# EAGLE schematic Interconnect_board_v1p12 (EAGLE 9.4.2)
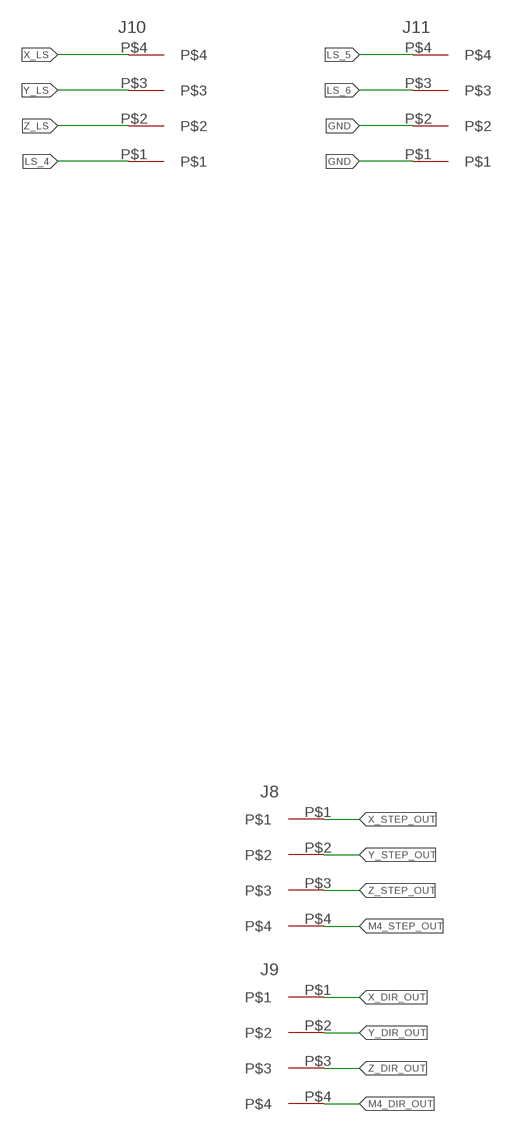
[diagram p0: schematic, sheet 1, part 1 of 2]
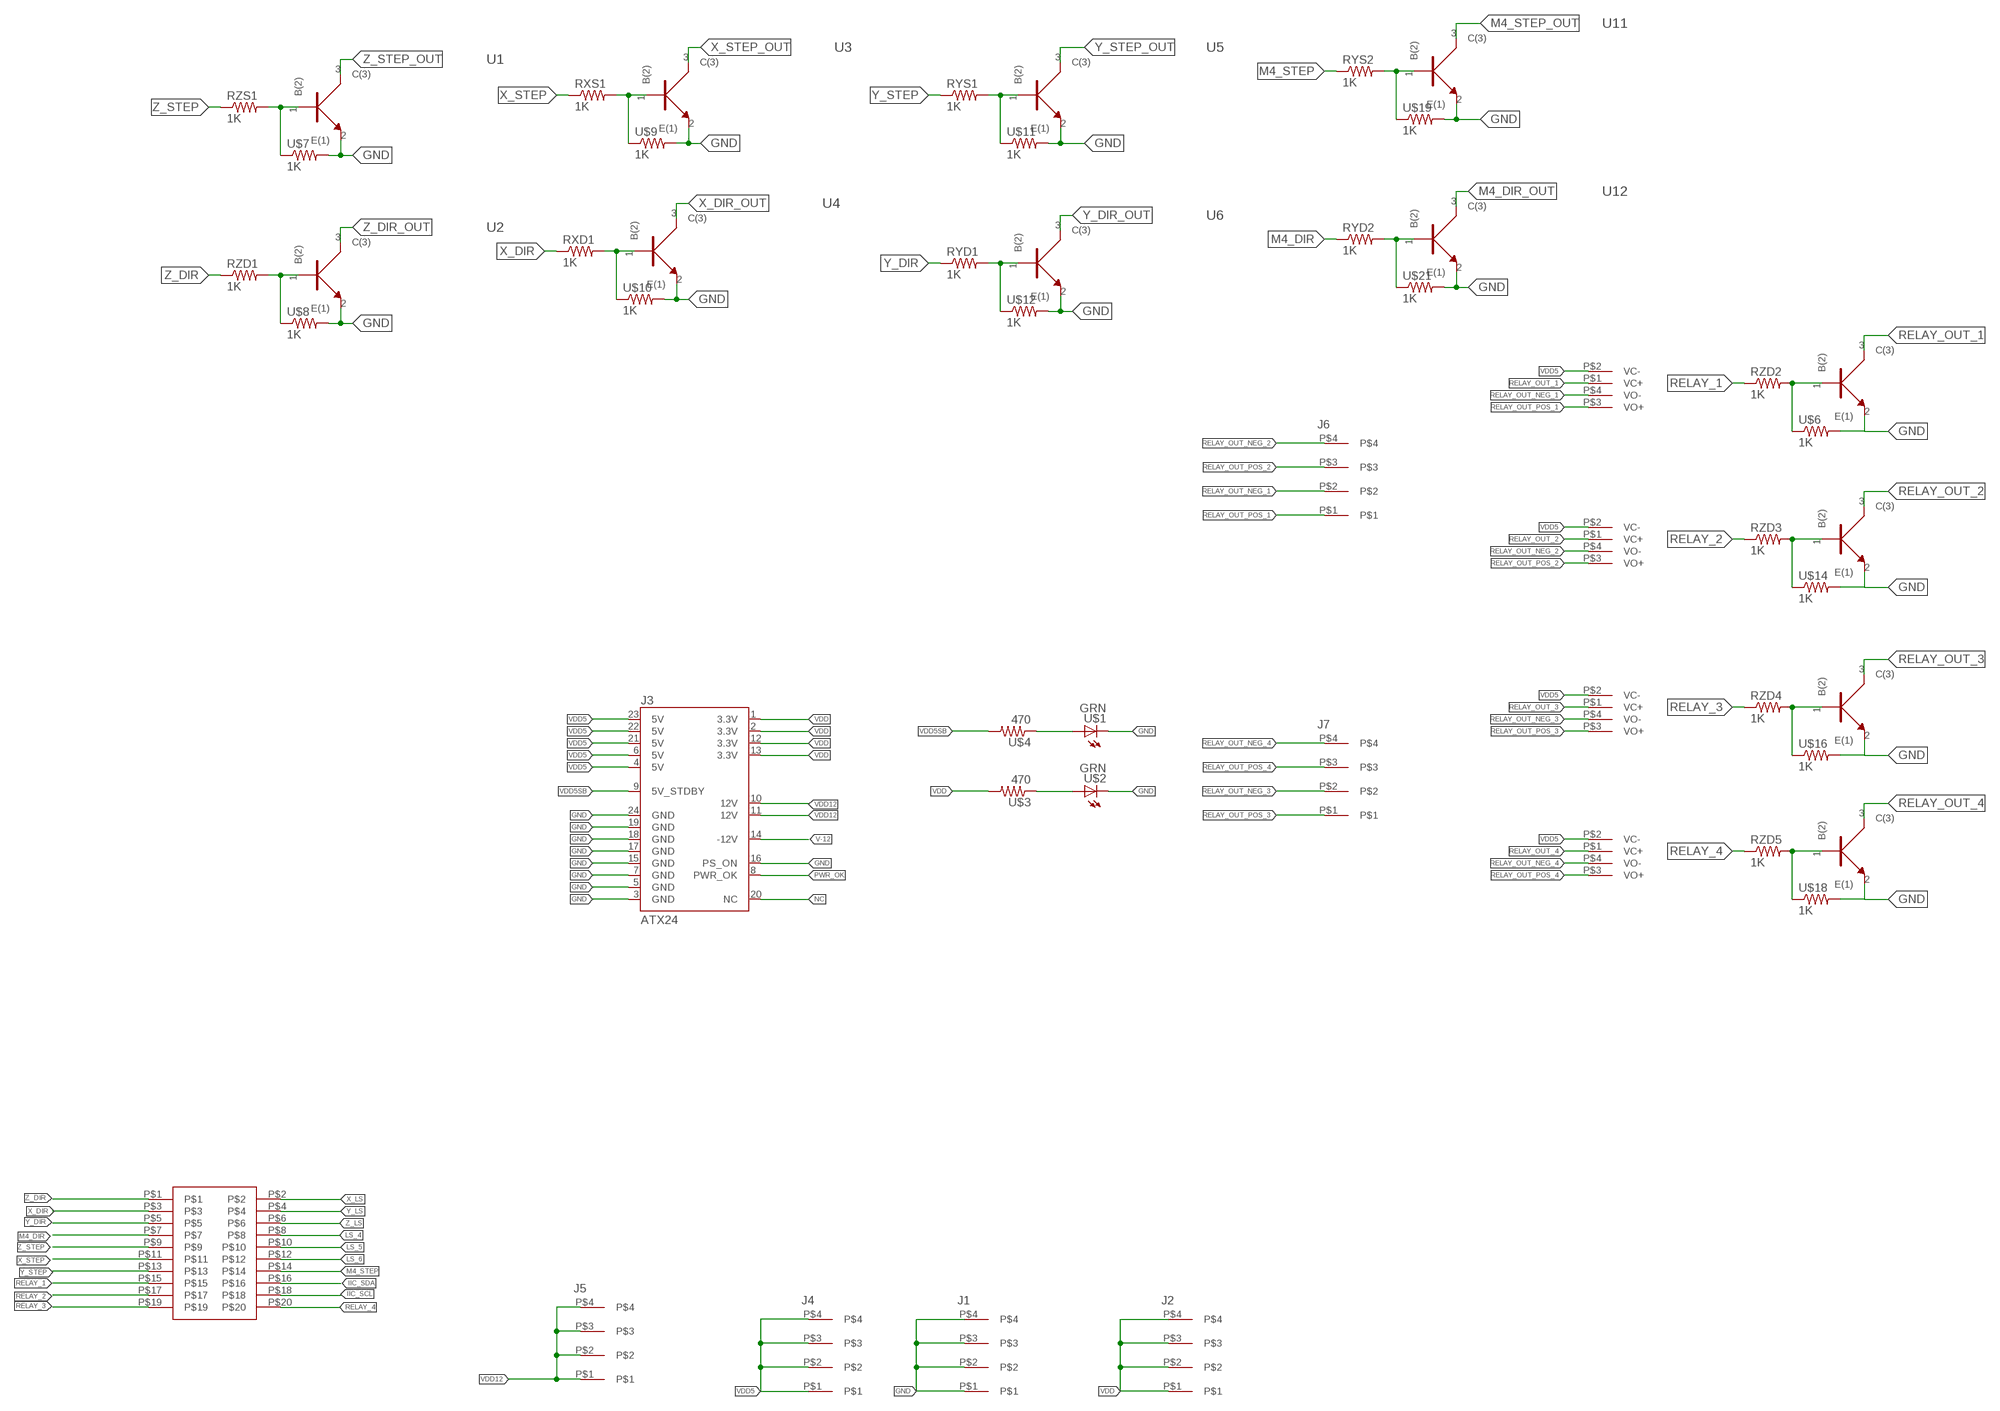
[diagram p1: schematic, sheet 1, part 2 of 2]

## Parts
J1  3.81MM_1_X_4_RT_ANGLE_PLUG_HEADER  [1X4_3.81MM_PITCH]
J2  3.81MM_1_X_4_RT_ANGLE_PLUG_HEADER  [1X4_3.81MM_PITCH]
J3  ATX24  [ATX24_STRAIGHT]
J4  3.81MM_1_X_4_RT_ANGLE_PLUG_HEADER  [1X4_3.81MM_PITCH]
J5  3.81MM_1_X_4_RT_ANGLE_PLUG_HEADER  [1X4_3.81MM_PITCH]
J6  3.81MM_1_X_4_RT_ANGLE_PLUG_HEADER  [1X4_3.81MM_PITCH]
J7  3.81MM_1_X_4_RT_ANGLE_PLUG_HEADER  [1X4_3.81MM_PITCH]
J8  3.81MM_1_X_4_RT_ANGLE_PLUG_HEADER  [1X4_3.81MM_PITCH]
J9  3.81MM_1_X_4_RT_ANGLE_PLUG_HEADER  [1X4_3.81MM_PITCH]
J10  3.81MM_1_X_4_RT_ANGLE_PLUG_HEADER  [1X4_3.81MM_PITCH]
J11  3.81MM_1_X_4_RT_ANGLE_PLUG_HEADER  [1X4_3.81MM_PITCH]
RXD1  R_0805_1K  [R_0805_1K]
RXS1  R_0805_1K  [R_0805_1K]
RYD1  R_0805_1K  [R_0805_1K]
RYD2  R_0805_1K  [R_0805_1K]
RYS1  R_0805_1K  [R_0805_1K]
RYS2  R_0805_1K  [R_0805_1K]
RZD1  R_0805_1K  [R_0805_1K]
RZD2  R_0805_1K  [R_0805_1K]
RZD3  R_0805_1K  [R_0805_1K]
RZD4  R_0805_1K  [R_0805_1K]
RZD5  R_0805_1K  [R_0805_1K]
RZS1  R_0805_1K  [R_0805_1K]
U1  BC846BW  [SOT323]
U2  BC846BW  [SOT323]
U3  BC846BW  [SOT323]
U4  BC846BW  [SOT323]
U5  BC846BW  [SOT323]
U6  BC846BW  [SOT323]
U7  BC846BW  [SOT323]
U8  BC846BW  [SOT323]
U9  BC846BW  [SOT323]
U10  BC846BW  [SOT323]
U11  BC846BW  [SOT323]
U12  BC846BW  [SOT323]
U$1  LED_0805_GREEN  [LED_0805_GREEN]
U$2  LED_0805_GREEN  [LED_0805_GREEN]
U$3  R_0805_470  [R_0805_470]
U$4  R_0805_470  [R_0805_470]
U$5  RELAY_KYOTO_KF0604D  [RELAY_KYOTO_KF0604D]
U$6  R_0805_1K  [R_0805_1K]
U$7  R_0805_1K  [R_0805_1K]
U$8  R_0805_1K  [R_0805_1K]
U$9  R_0805_1K  [R_0805_1K]
U$10  R_0805_1K  [R_0805_1K]
U$11  R_0805_1K  [R_0805_1K]
U$12  R_0805_1K  [R_0805_1K]
U$13  RELAY_KYOTO_KF0604D  [RELAY_KYOTO_KF0604D]
U$14  R_0805_1K  [R_0805_1K]
U$15  RELAY_KYOTO_KF0604D  [RELAY_KYOTO_KF0604D]
U$16  R_0805_1K  [R_0805_1K]
U$17  RELAY_KYOTO_KF0604D  [RELAY_KYOTO_KF0604D]
U$18  R_0805_1K  [R_0805_1K]
U$19  R_0805_1K  [R_0805_1K]
U$21  R_0805_1K  [R_0805_1K]
U$26  2_X_10_HEADER_GENERIC  [2_X_10_.1_INCH]

## Nets
GND: J1.P$1 J1.P$2 J1.P$3 J1.P$4 J3.3(GND) J3.5(GND) J3.7(GND) J3.15(GND) J3.16(PS_ON) J3.17(GND) J3.18(GND) J3.19(GND) J3.24(GND) J11.P$1 J11.P$2 U1.2(E(1)) U2.2(E(1)) U3.2(E(1)) U4.2(E(1)) U5.2(E(1)) U6.2(E(1)) U7.2(E(1)) U8.2(E(1)) U9.2(E(1)) U10.2(E(1)) U11.2(E(1)) U12.2(E(1)) U$1.C U$2.C U$6.2 U$7.2 U$8.2 U$9.2 U$10.2 U$11.2 U$12.2 U$14.2 U$16.2 U$18.2 U$19.2 U$21.2
IIC_SCL: U$26.P$18
IIC_SDA: U$26.P$16
LS_4: J10.P$1 U$26.P$8
LS_5: J11.P$4 U$26.P$10
LS_6: J11.P$3 U$26.P$12
M4_DIR: RYD2.1 U$26.P$7
M4_DIR_OUT: J9.P$4 U12.3(C(3))
M4_STEP: RYS2.1 U$26.P$14
M4_STEP_OUT: J8.P$4 U11.3(C(3))
N$1: RXS1.2 U3.1(B(2)) U$9.1
N$2: RZD3.2 U8.1(B(2)) U$14.1
N$3: RZD1.2 U2.1(B(2)) U$8.1
N$4: U$1.A U$4.1
N$5: U$2.A U$3.1
N$6: RZD4.2 U9.1(B(2)) U$16.1
N$7: RZS1.2 U1.1(B(2)) U$7.1
N$8: RZD2.2 U7.1(B(2)) U$6.1
N$9: RYS1.2 U5.1(B(2)) U$11.1
N$10: RZD5.2 U10.1(B(2)) U$18.1
N$15: RXD1.2 U4.1(B(2)) U$10.1
N$18: RYD1.2 U6.1(B(2)) U$12.1
N$21: RYS2.2 U11.1(B(2)) U$19.1
N$22: RYD2.2 U12.1(B(2)) U$21.1
NC: J3.20(NC)
PWR_OK: J3.8(PWR_OK)
RELAY_1: RZD2.1 U$26.P$15
RELAY_2: RZD3.1 U$26.P$17
RELAY_3: RZD4.1 U$26.P$19
RELAY_4: RZD5.1 U$26.P$20
RELAY_OUT_1: U7.3(C(3)) U$5.P$1(VC+)
RELAY_OUT_2: U8.3(C(3)) U$13.P$1(VC+)
RELAY_OUT_3: U9.3(C(3)) U$15.P$1(VC+)
RELAY_OUT_4: U10.3(C(3)) U$17.P$1(VC+)
RELAY_OUT_NEG_1: J6.P$2 U$5.P$4(VO-)
RELAY_OUT_NEG_2: J6.P$4 U$13.P$4(VO-)
RELAY_OUT_NEG_3: J7.P$2 U$15.P$4(VO-)
RELAY_OUT_NEG_4: J7.P$4 U$17.P$4(VO-)
RELAY_OUT_POS_1: J6.P$1 U$5.P$3(VO+)
RELAY_OUT_POS_2: J6.P$3 U$13.P$3(VO+)
RELAY_OUT_POS_3: J7.P$1 U$15.P$3(VO+)
RELAY_OUT_POS_4: J7.P$3 U$17.P$3(VO+)
V-12: J3.14(-12V)
VDD: J2.P$1 J2.P$2 J2.P$3 J2.P$4 J3.1(3.3V) J3.2(3.3V) J3.12(3.3V) J3.13(3.3V) U$3.2
VDD5: J3.4(5V) J3.6(5V) J3.21(5V) J3.22(5V) J3.23(5V) J4.P$1 J4.P$2 J4.P$3 J4.P$4 U$5.P$2(VC-) U$13.P$2(VC-) U$15.P$2(VC-) U$17.P$2(VC-)
VDD5SB: J3.9(5V_STDBY) U$4.2
VDD12: J3.10(12V) J3.11(12V) J5.P$1 J5.P$2 J5.P$3 J5.P$4
X_DIR: RXD1.1 U$26.P$3
X_DIR_OUT: J9.P$1 U4.3(C(3))
X_LS: J10.P$4 U$26.P$2
X_STEP: RXS1.1 U$26.P$11
X_STEP_OUT: J8.P$1 U3.3(C(3))
Y_DIR: RYD1.1 U$26.P$5
Y_DIR_OUT: J9.P$2 U6.3(C(3))
Y_LS: J10.P$3 U$26.P$4
Y_STEP: RYS1.1 U$26.P$13
Y_STEP_OUT: J8.P$2 U5.3(C(3))
Z_DIR: RZD1.1 U$26.P$1
Z_DIR_OUT: J9.P$3 U2.3(C(3))
Z_LS: J10.P$2 U$26.P$6
Z_STEP: RZS1.1 U$26.P$9
Z_STEP_OUT: J8.P$3 U1.3(C(3))

## Library data of the parts
J1 J2 J4-J11 = 3D_MIG_Controller:3.81MM_1_X_4_RT_ANGLE_PLUG_HEADER
J3 = 3D_MIG_Controller:ATX24: ATX24 Pin Power Supply Connector - Right Angle PTH Mount This is a good connector for connecting a computer power supply to a PCB. It's massive, but provides many amps of power at 5V and 12V. SparkFun Products: SparkFun Benchtop Power Board Kit <https://www.sparkfun.com/products/12867> SparkFun Power Driver Shield Kit <https://www.sparkfun.com/products/10618>
RXD1 RXS1 RYD1 RYD2 RYS1 RYS2 RZD1-RZD5 RZS1 U$6-U$12 U$14 U$16 U$18 U$19 U$21 = 3D_MIG_Controller:R_0805_1K
U1-U12 = 3D_MIG_Controller:BC846BW; MANUFACTURER_PART_NUMBER: BC846BW; VENDOR: Nexperia
U$1 U$2 = 3D_MIG_Controller:LED_0805_GREEN
U$3 U$4 = 3D_MIG_Controller:R_0805_470
U$5 U$13 U$15 U$17 = 3D_MIG_Controller:RELAY_KYOTO_KF0604D
U$26 = 3D_MIG_Controller:2_X_10_HEADER_GENERIC